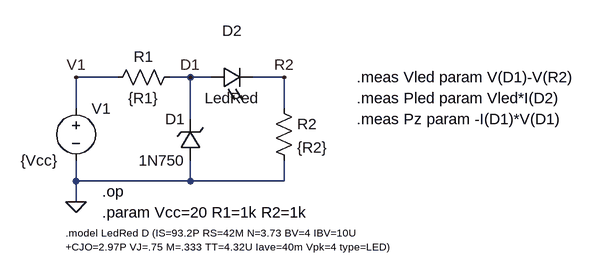
[diagram p0: schematic DR04op.asc]
DR04op.asc, the LTspice schematic file:
Version 4
SHEET 1 1000 680
WIRE 112 0 48 0
WIRE 224 0 192 0
WIRE 256 0 224 0
WIRE 368 0 320 0
WIRE 48 48 48 0
WIRE 368 48 368 0
WIRE 224 64 224 0
WIRE 48 160 48 128
WIRE 224 160 224 128
WIRE 224 160 48 160
WIRE 368 160 368 128
WIRE 368 160 224 160
WIRE 48 192 48 160
FLAG 48 192 0
FLAG 48 0 V1
FLAG 224 0 D1
FLAG 368 0 R2
SYMBOL voltage 48 32 R0
WINDOW 123 0 0 Left 0
WINDOW 39 0 0 Left 0
WINDOW 3 -85 96 Left 2
SYMATTR InstName V1
SYMATTR Value {Vcc}
SYMBOL LED 256 16 R270
WINDOW 0 72 32 VTop 2
WINDOW 3 0 32 VBottom 2
SYMATTR InstName D2
SYMATTR Value LedRed
SYMBOL res 208 -16 R90
WINDOW 0 0 56 VBottom 2
WINDOW 3 32 56 VTop 2
SYMATTR InstName R1
SYMATTR Value {R1}
SYMBOL res 352 32 R0
SYMATTR InstName R2
SYMATTR Value {R2}
SYMBOL zener 240 128 R180
WINDOW 0 24 64 Left 2
WINDOW 3 24 0 Left 2
SYMATTR InstName D1
SYMATTR Value 1N750
TEXT 88 176 Left 2 !.op
TEXT 88 208 Left 2 !.param Vcc=20 R1=1k R2=1k
TEXT 32 240 Left 1 !.model LedRed D (IS=93.2P RS=42M N=3.73 BV=4 IBV=10U \n+CJO=2.97P VJ=.75 M=.333 TT=4.32U Iave=40m Vpk=4 type=LED)
TEXT 480 0 Left 2 !.meas Vled param V(D1)-V(R2)
TEXT 480 32 Left 2 !.meas Pled param Vled*I(D2)
TEXT 480 64 Left 2 !.meas Pz param -I(D1)*V(D1)

The netlist it stands for:
* DR04op.asc
V1 V1 0 {Vcc}
D2 D1 R2 LedRed
R1 D1 V1 {R1}
R2 R2 0 {R2}
D1 0 D1 1N750
.model D D
.lib standard.dio
.op
.param Vcc=20 R1=1k R2=1k
.model LedRed D (IS=93.2P RS=42M N=3.73 BV=4 IBV=10U
+CJO=2.97P VJ=.75 M=.333 TT=4.32U Iave=40m Vpk=4 type=LED)
.meas Vled param V(D1)-V(R2)
.meas Pled param Vled*I(D2)
.meas Pz param -I(D1)*V(D1)
.backanno
.end